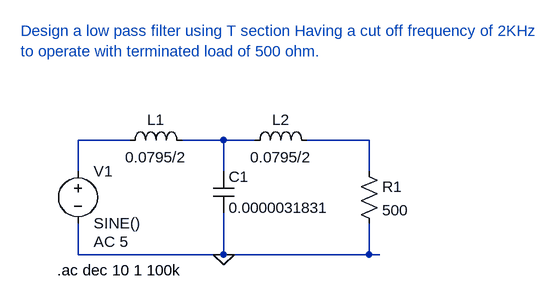
[diagram p0: schematic 1_Dheerendra_23EE019_Lowpass_filter.asc]
1_Dheerendra_23EE019_Lowpass_filter.asc, the LTspice schematic file:
Version 4
SHEET 1 1336 680
WIRE 64 112 -16 112
WIRE 208 112 144 112
WIRE 256 112 208 112
WIRE 432 112 336 112
WIRE -16 160 -16 112
WIRE 208 160 208 112
WIRE 432 160 432 112
WIRE -16 288 -16 240
WIRE 208 288 208 224
WIRE 208 288 -16 288
WIRE 432 288 432 240
WIRE 432 288 208 288
WIRE 448 288 432 288
FLAG 208 288 0
SYMBOL ind 48 128 R270
WINDOW 0 32 56 VTop 2
WINDOW 3 5 56 VBottom 2
SYMATTR InstName L1
SYMATTR Value 0.0795/2
SYMBOL ind 240 128 R270
WINDOW 0 32 56 VTop 2
WINDOW 3 5 56 VBottom 2
SYMATTR InstName L2
SYMATTR Value 0.0795/2
SYMBOL cap 192 160 R0
SYMATTR InstName C1
SYMATTR Value 0.0000031831
SYMBOL voltage -16 144 R0
WINDOW 123 24 124 Left 2
WINDOW 39 0 0 Left 0
SYMATTR InstName V1
SYMATTR Value SINE()
SYMATTR Value2 AC 5
SYMBOL res 416 144 R0
SYMATTR InstName R1
SYMATTR Value 500
TEXT -48 312 Left 2 !.ac dec 10 1 100k
TEXT -104 -56 Left 2 ;Design a low pass filter using T section Having a cut off frequency of 2KHz\nto operate with terminated load of 500 ohm.

The netlist it stands for:
* 1_Dheerendra_23EE019_Lowpass_filter.asc
L1 N001 N002 0.0795/2
L2 N002 N003 0.0795/2
C1 N002 0 0.0000031831
V1 N001 0 SINE() AC 5
R1 N003 0 500
.ac dec 10 1 100k
* Design a low pass filter using T section Having a cut off frequency of 2KHz
* to operate with terminated load of 500 ohm.
.backanno
.end